# Altium project sgnd_rings.PrjPcb
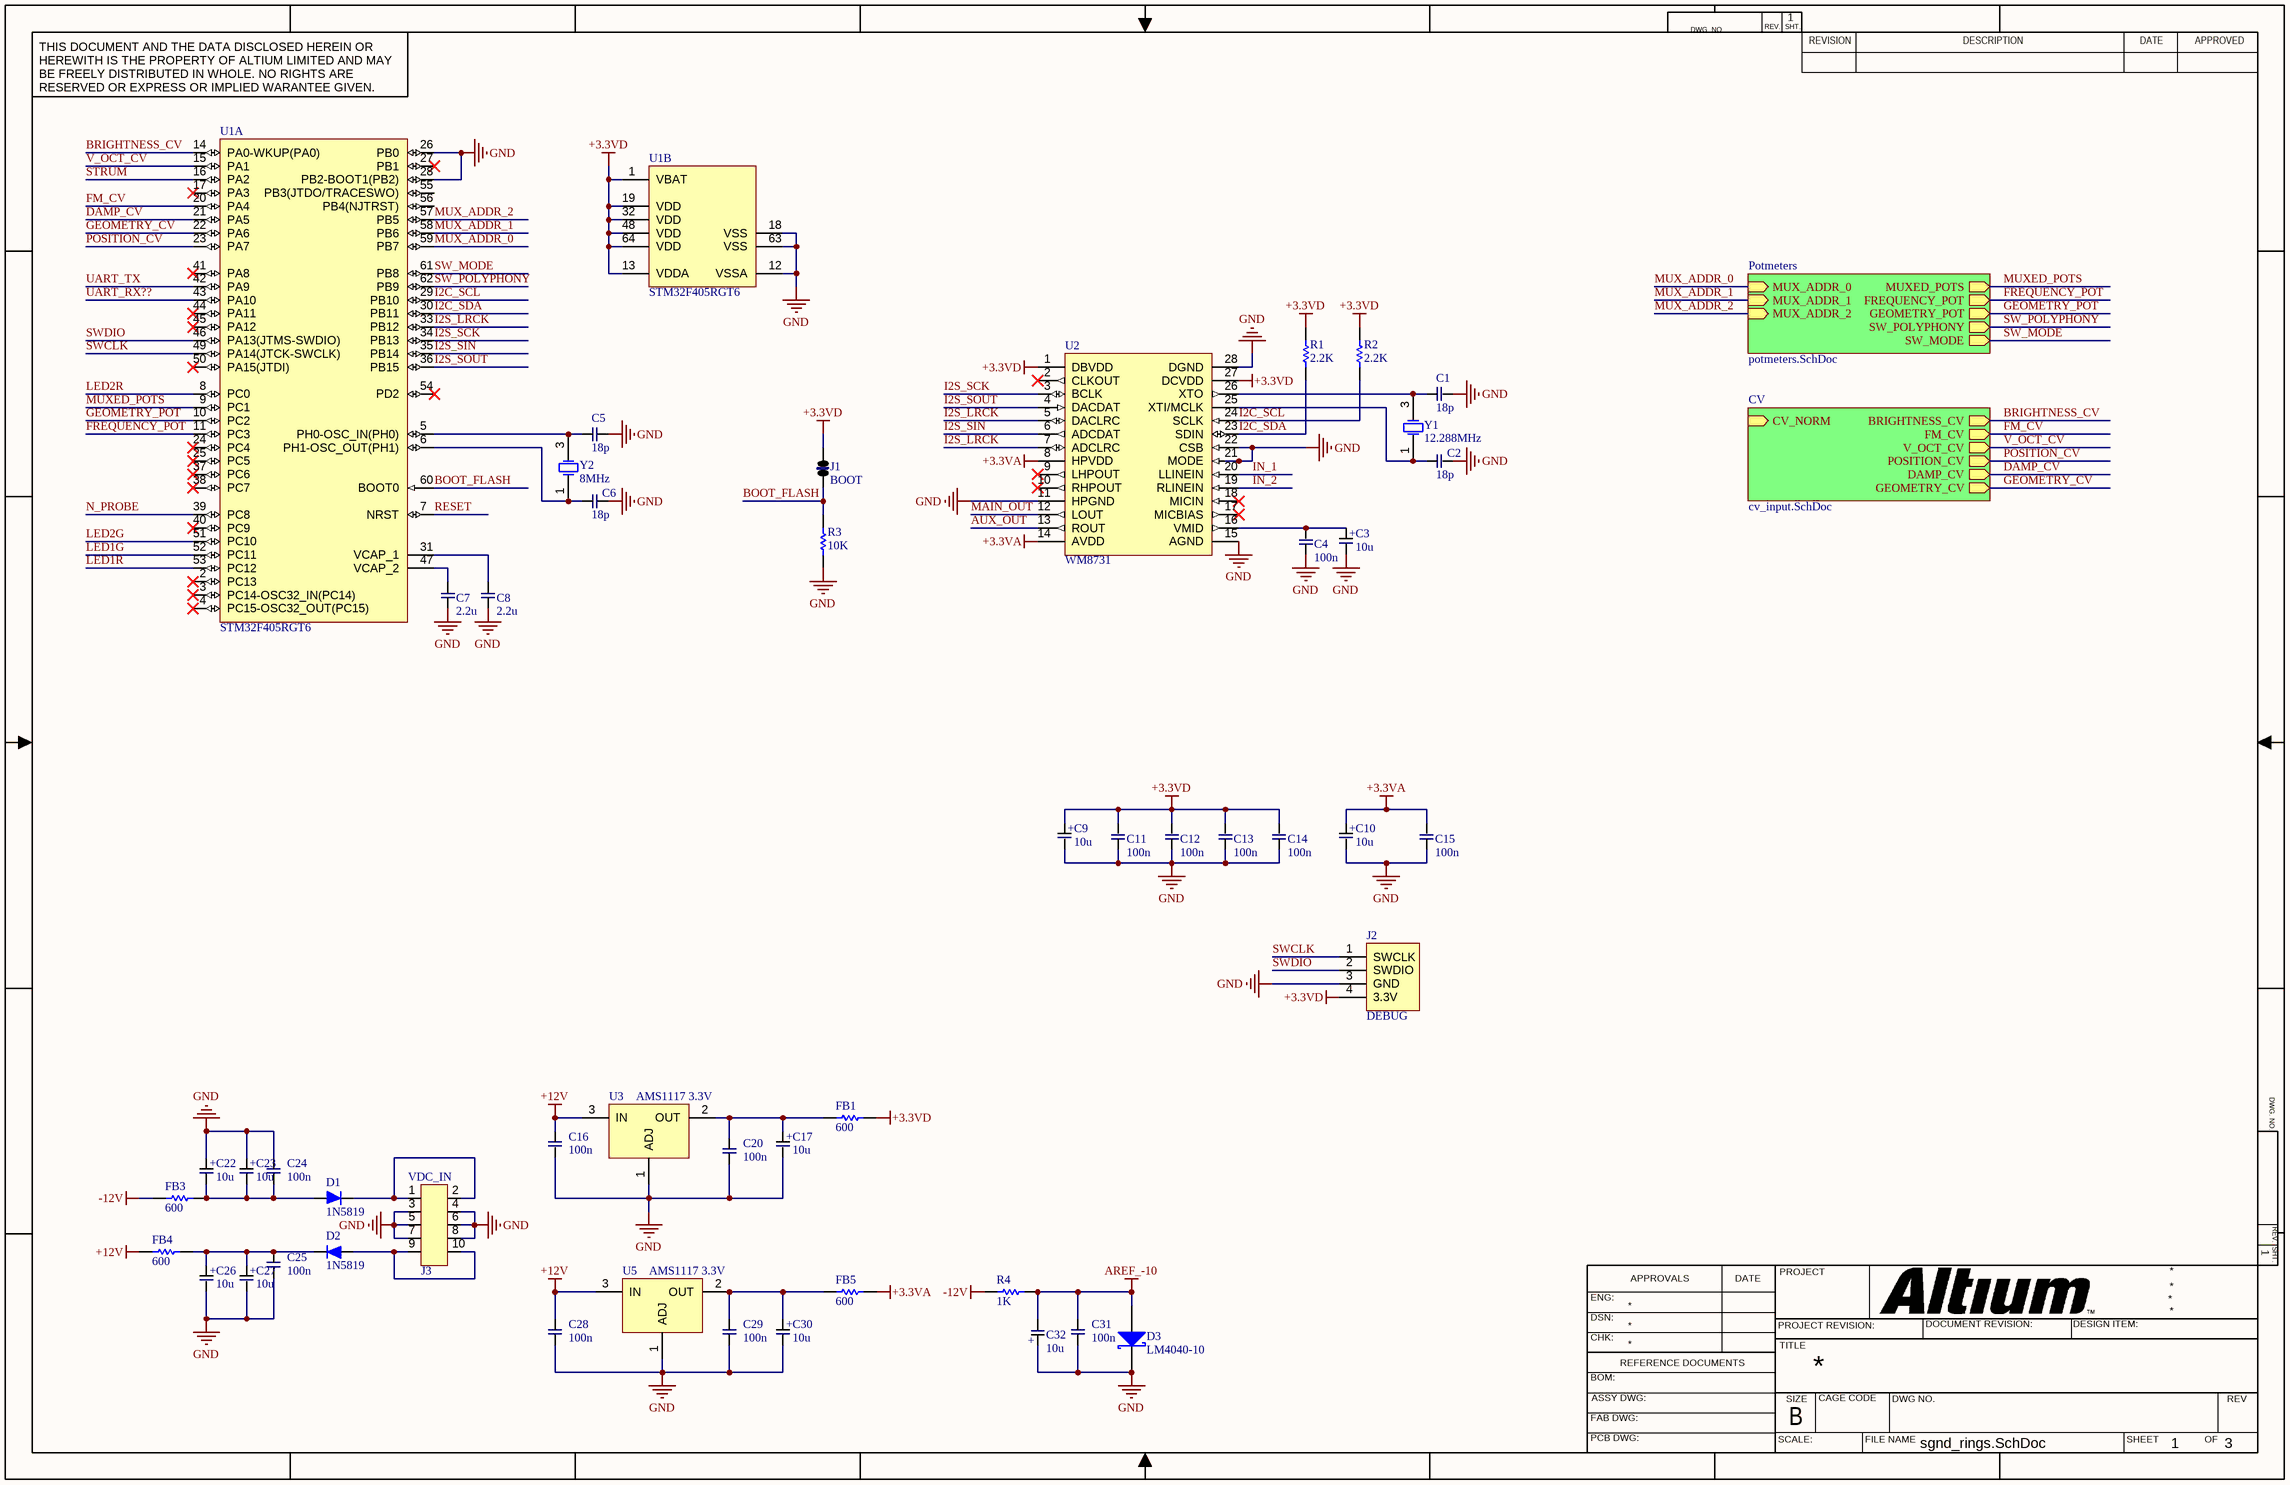
[diagram p0: sgnd_rings.SchDoc]
4 sheets, 109 parts. Net scope: hierarchical (ports join the sheet entries above them; power ports are global).
Board file: sgnd_rings.PcbDoc
Sheets:
  sgnd_rings.SchDoc
    Potmeters = potmeters.SchDoc
    CV = cv_input.SchDoc
  audio.SchDoc

## Sheet sgnd_rings.SchDoc
size 431 x 279 mm; SheetNumber: 1; SheetTotal: 3

### Parts
C1  value 18p  [C0603]  (hidden comment: Capacitor)
C2  value 18p  [C0603]  (hidden comment: Capacitor)
C3  value 10u  [ELCO_SMD_4x5.3mm]  (hidden comment: C_ELCO)
C4  value 100n  [C0603]  (hidden comment: Capacitor)
C5  value 18p  [C0603]  (hidden comment: Capacitor)
C6  value 18p  [C0603]  (hidden comment: Capacitor)
C7  value 2.2u  [C0603]  (hidden comment: Capacitor)
C8  value 2.2u  [C0603]  (hidden comment: Capacitor)
C9  value 10u  [ELCO_SMD_4x5.3mm]  (hidden comment: C_ELCO)
C10  value 10u  [ELCO_SMD_4x5.3mm]  (hidden comment: C_ELCO)
C11  value 100n  [C0603]  (hidden comment: Capacitor)
C12  value 100n  [C0603]  (hidden comment: Capacitor)
C13  value 100n  [C0603]  (hidden comment: Capacitor)
C14  value 100n  [C0603]  (hidden comment: Capacitor)
C15  value 100n  [C0603]  (hidden comment: Capacitor)
C16  value 100n  [C0603]  (hidden comment: Capacitor)
C17  value 10u  [ELCO_SMD_4x5.3mm]  (hidden comment: C_ELCO)
C20  value 100n  [C0603]  (hidden comment: Capacitor)
C22  value 10u  [ELCO_SMD_4x5.3mm]  (hidden comment: C_ELCO)
C23  value 10u  [ELCO_SMD_4x5.3mm]  (hidden comment: C_ELCO)
C24  value 100n  [C0603]  (hidden comment: Capacitor)
C25  value 100n  [C0603]  (hidden comment: Capacitor)
C26  value 10u  [ELCO_SMD_4x5.3mm]  (hidden comment: C_ELCO)
C27  value 10u  [ELCO_SMD_4x5.3mm]  (hidden comment: C_ELCO)
C28  value 100n  [C0603]  (hidden comment: Capacitor)
C29  value 100n  [C0603]  (hidden comment: Capacitor)
C30  value 10u  [ELCO_SMD_4x5.3mm]  (hidden comment: C_ELCO)
C31  value 100n  [C0603]  (hidden comment: Capacitor)
C32  value 10u  [ELCO_SMD_4x5.3mm]  (hidden comment: C_ELCO)
D1  value 1N5819  [DIODE_SOD-123]  (hidden comment: 1N4148)
D2  value 1N5819  [DIODE_SOD-123]  (hidden comment: 1N4148)
D3  LM4040-10  [SOT-23_M]
FB1  value 600  [R0603]  (hidden comment: RESISTOR)
FB3  value 600  [R0603]  (hidden comment: RESISTOR)
FB4  value 600  [R0603]  (hidden comment: RESISTOR)
FB5  value 600  [R0603]  (hidden comment: RESISTOR)
J1  BOOT  [JUMPER_2.54]
J2  DEBUG  [4PIN_CONNECTOR_VERTICAL_1,25MM_P - duplicate]
J3  IDC_socket_10pin  [IDC10]  (value not drawn)
R1  value 2.2K  [R0603]  (hidden comment: RESISTOR)
R2  value 2.2K  [R0603]  (hidden comment: RESISTOR)
R3  value 10K  [R0603]  (hidden comment: RESISTOR)
R4  value 1K  [R0603]  (hidden comment: RESISTOR)
U1  STM32F405RGT6  [STM-LQFP64_N]  (parts A,B of 2)
U2  WM8731  [SSOP-28_L]
U3  value AMS1117 3.3V  [SOT223]  (hidden comment: AMS1117_5V)
U5  value AMS1117 3.3V  [SOT223]  (hidden comment: AMS1117_5V)
Y1  12.288MHz  [XTAL_SMD_3.2x2.5x0.8]
Y2  8MHz  [XTAL_SMD_3.2x2.5x0.8]

### Sub-sheets
CV = cv_input.SchDoc: BRIGHTNESS_CV (out), FM_CV (out), V_OCT_CV (out), POSITION_CV (out), DAMP_CV (out), GEOMETRY_CV (out), CV_NORM (in)
Potmeters = potmeters.SchDoc: MUX_ADDR_0 (in), MUX_ADDR_1 (in), MUX_ADDR_2 (in), MUXED_POTS (out), FREQUENCY_POT (out), GEOMETRY_POT (out), SW_POLYPHONY (out), SW_MODE (out)

### Nets
+3.3VA: C10.1(+) C15.2 FB5.1 U2.8(HPVDD) U2.14(AVDD)
+3.3VD: C9.1(+) C11.2 C12.2 C13.2 C14.2 FB1.1 J1.2(C2) J2.4(3.3V) R1.2 R2.2 U1.1(VBAT) U1.13(VDDA) U1.19(VDD) U1.32(VDD) U1.48(VDD) U1.64(VDD) U2.1(DBVDD) U2.27(DCVDD)
+12V: C16.1 C28.1 FB4.2 U3.3(IN) U5.3(IN)
-12V: FB3.2 R4.2
AREF_-10: C31.1 C32.2(-) D3.2(-) R4.1
GND: C1.2 C2.2 C3.2(-) C4.1 C5.2 C6.2 C7.1 C8.1 C9.2(-) C10.2(-) C11.1 C12.1 C13.1 C14.1 C15.1 C16.2 C17.2(-) C20.2 C22.1(+) C23.1(+) C24.1 C25.2 C26.2(-) C27.2(-) C28.2 C29.2 C30.2(-) C31.2 C32.1(+) D3.1(+) J2.3(GND) J3.3 J3.4 J3.5 J3.6 J3.7 J3.8 R3.1 U1.12(VSSA) U1.18(VSS) U1.26(PB0) U1.28(PB2-BOOT1(PB2)) U1.63(VSS) U2.11(HPGND) U2.15(AGND) U2.21(MODE) U2.22(CSB) U2.28(DGND) U3.1(ADJ) U5.1(ADJ)
AUX_OUT: U2.13(ROUT)
BOOT_FLASH: J1.1(C1) R3.2 U1.60(BOOT0)
BRIGHTNESS_CV: U1.14(PA0-WKUP(PA0)) ; sheet CV/BRIGHTNESS_CV
DAMP_CV: U1.21(PA5) ; sheet CV/DAMP_CV
FM_CV: U1.20(PA4) ; sheet CV/FM_CV
FREQUENCY_POT: U1.11(PC3) ; sheet Potmeters/FREQUENCY_POT
GEOMETRY_CV: U1.22(PA6) ; sheet CV/GEOMETRY_CV
GEOMETRY_POT: U1.10(PC2) ; sheet Potmeters/GEOMETRY_POT
I2C_SCL: R2.1 U1.29(PB10) U2.24(SCLK)
I2C_SDA: R1.1 U1.30(PB11) U2.23(SDIN)
I2S_LRCK: U1.33(PB12) U2.5(DACLRC) U2.7(ADCLRC)
I2S_SCK: U1.34(PB13) U2.3(BCLK)
I2S_SIN: U1.35(PB14) U2.6(ADCDAT)
I2S_SOUT: U1.36(PB15) U2.4(DACDAT)
IN_1: U2.20(LLINEIN)
IN_2: U2.19(RLINEIN)
LED1G: U1.52(PC11)
LED1R: U1.53(PC12)
LED2G: U1.51(PC10)
LED2R: U1.8(PC0)
MAIN_OUT: U2.12(LOUT)
MUX_ADDR_0: U1.59(PB7) ; sheet Potmeters/MUX_ADDR_0
MUX_ADDR_1: U1.58(PB6) ; sheet Potmeters/MUX_ADDR_1
MUX_ADDR_2: U1.57(PB5) ; sheet Potmeters/MUX_ADDR_2
MUXED_POTS: U1.9(PC1) ; sheet Potmeters/MUXED_POTS
N_PROBE: U1.39(PC8)
POSITION_CV: U1.23(PA7) ; sheet CV/POSITION_CV
RESET: U1.7(NRST)
STRUM: U1.16(PA2)
SW_MODE: U1.61(PB8) ; sheet Potmeters/SW_MODE
SW_POLYPHONY: U1.62(PB9) ; sheet Potmeters/SW_POLYPHONY
SWCLK: J2.1(SWCLK) U1.49(PA14(JTCK-SWCLK))
SWDIO: J2.2(SWDIO) U1.46(PA13(JTMS-SWDIO))
UART_RX??: U1.43(PA10)
UART_TX: U1.42(PA9)
V_OCT_CV: U1.15(PA1) ; sheet CV/V_OCT_CV
NetC1_1: C1.1 U2.26(XTO) Y1.3(OSC2)
NetC2_1: C2.1 U2.25(XTI/MCLK) Y1.1(OSC1)
NetC3_1: C3.1(+) C4.2 U2.16(VMID)
NetC5_1: C5.1 U1.5(PH0-OSC_IN(PH0)) Y2.3(OSC2)
NetC6_1: C6.1 U1.6(PH1-OSC_OUT(PH1)) Y2.1(OSC1)
NetC7_2: C7.2 U1.47(VCAP_2)
NetC8_2: C8.2 U1.31(VCAP_1)
NetC17_1: C17.1(+) C20.1 FB1.2 U3.2(OUT)
NetC22_2: C22.2(-) C23.2(-) C24.2 D1.2(A) FB3.1
NetC25_1: C25.1 C26.1(+) C27.1(+) D2.1(K) FB4.1
NetC29_1: C29.1 C30.1(+) FB5.2 U5.2(OUT)
NetD1_1: D1.1(K) J3.1 J3.2
NetD2_2: D2.2(A) J3.9 J3.10

Not connected (* = marked no-connect by the designer): U1 2(PC13)* 3(PC14-OSC32_IN(PC14))* 4(PC15-OSC32_OUT(PC15))* 17(PA3)* 24(PC4)* 25(PC5)* 27(PB1)* 37(PC6)* 38(PC7)* 40(PC9)* 41(PA8)* 44(PA11)* 45(PA12)* 50(PA15(JTDI))* 54(PD2)* 55(PB3(JTDO/TRACESWO)) 56(PB4(NJTRST)); U2 2(CLKOUT)* 9(LHPOUT)* 10(RHPOUT)* 17(MICBIAS)* 18(MICIN)*

### Notes on the sheet
- (near J3) VDC_IN
- DWG. NO.
- REV.
- SHT.
- THIS DOCUMENT AND THE DATA DISCLOSED HEREIN OR HEREWITH IS THE PROPERTY OF ALTIUM LIMITED AND MAY BE FREELY DISTRIBUTED IN WHOLE. NO RIGHTS ARE RESERVED OR EXPRESS OR IMPLIED WARANTEE GIVEN.
- REVISION
- DESCRIPTION
- DATE
- APPROVED
- ENG:
- APPROVALS
- PROJECT
- DSN:
- CHK:
- REFERENCE DOCUMENTS
- PROJECT REVISION:
- TITLE
- DOCUMENT REVISION:
- DESIGN ITEM:
- BOM:
- FAB DWG:
- PCB DWG:
- ASSY DWG:
- SCALE:
- SIZE
- B
- CAGE CODE
- FILE NAME
- DWG NO.
- SHEET
- OF
- REV

### Library data of the parts
C1 C2 C4-C8 C11-C16 C20 C24 C25 C28 C29 C31 = Capacitor: Capacitor (Semiconductor SIM Model); Published: 8-Jun-2000; LatestRevisionDate: 29-May-2009; LatestRevisionNote: IPC-7351 Footprint Added.; PackageReference: C1206; Publisher: Altium Limited; PackageDescription: Chip Capacitor
D1 D2 = 1N5819: 1 Amp General Purpose Rectifier; Published: 8-Jun-2000; LatestRevisionDate: 17-Jul-2002; LatestRevisionNote: Re-released for DXP Platform.; DatasheetVersion: 1998; PackageVersion: Aug-1999; PackageReference: DO-41; Publisher: Altium Limited; PackageDescription: Diode, Axial; Body 5.2 x 2.7 mm (LxDia. max), Lead Dia. 0.86 mm (max); Code_JEDEC: DO-204-AL
D3 = LM4040-10: LM4040 Precision Micropower Shunt Voltage Reference 10V; Value: LM4040-10; JLC Part Number: C201738
J1 = Jumper: Jumper Wire; Published: 24-Mar-1999; LatestRevisionDate: 17-Jul-2002; LatestRevisionNote: Re-released for DXP Platform.; PackageReference: RAD-0.2; Publisher: Altium Limited; PackageDescription: Radial Cap, Thru-Hole; 2 Leads; 0.2 in Pin Spacing
J2 = STM32_SWD_PROGRAMMER: Value: STM32_SWD_PROGRAMMER
J3 = IDC_socket_10pin: Value: IDC10 socket
U1 = STM32F405RGT6: ARM Cortex-M4 32-bit MCU+FPU, 210 DMIPS, 1024 kB Flash, 192 kB Internal RAM, 51 I/Os, 64-pin LQFP, -40 to 85 degC, Tray; Manufacturer: STMicroelectronics; D/A Converter: 2x12-bit; FLASH Size (Prog) (kB): 1024; I/Os (High Current): 51; Internal RAM Size (kB): 192; Operating Frequency(F) (Processor speed) (MHz): 168; Supply Voltage(Vcc) max (V): 3.6; Supply Voltage(Vcc) min (V): 1.8; DatasheetVersion: Rev. 4; PackageVersion: Rev. 4, 06/2013; PackageReference: LQFP64; PackageDescription: 64-Pin Low Profile Quad Flat Package, 10 x 10 mm Body, 0.5 mm Pitch; Supplier 1: Digi-Key; Supplier Part Number 1: 497-11767-ND; Supplier 2: Farnell; Supplier Part Number 2: 2064363; Supplier 3: Newark; Supplier Part Number 3: 73T2329; Supplier 4: Mouser; Supplier Part Number 4: 511-STM32F405RGT6; Core: ARM Cortex-M4; Packing: Tray; Mounting Technology: Surface Mount; PartNumber: STM32F405RGT6; ComponentLink1Description: Manufacturer URL; ComponentLink1URL: http://www.st.com/web/en/home.html; ComponentLink2Description: Datasheet; ComponentLink2URL: http://www.st.com/st-web-ui/static/active/en/resource/technical/document/datasheet/DM00037051.pdf; ComponentLink3Description: Package Specification; ComponentLink3URL: http://www.st.com/st-web-ui/static/active/en/resource/technical/document/datasheet/DM00037051.pdf
U2 = WM8731: Portable Internet Audio CODEC with Headphone Driver / and Programmable Sample Rates; Manufacturer: Microchip; PartNumber: MCP4822-E/P; DatasheetVersion: revA, Apr-2010; PackageVersion: revBB, Aug-2009; PackageReference: PDIP300-P8; PackageDescription: 8-Lead Plastic Dual In-Line (P) - 300 mil Body [PDIP]; Supplier 1: Digi-Key; Supplier Part Number 1: MCP4822-E/P-ND; Supplier 2: Farnell; Supplier Part Number 2: 1439413; Supplier 3: Newark; Supplier Part Number 3: 11M1705; Supplier 4: Mouser; Supplier Part Number 4: 579-MCP4822-E/P; Mounting Technology: Through Hole; Code_JEDEC: MS-001; Value: WM8731
Y1 Y2 = XTAL_3225-24.576M-SR: Crystal Oscillator; Value: XTAL; Published: 8-Jun-2000; LatestRevisionDate: 17-Jul-2002; LatestRevisionNote: Re-released for DXP Platform.; PackageReference: R38; Publisher: Altium Limited; PackageDescription: Crystal, Thru-Hole; 2 Leads; Body 3.1 x 8.2 mm (Dia.xH)
FB1 FB3-FB5 R1-R4 = RESISTOR: Published: 8-Jun-2000; LatestRevisionDate: 17-Jul-2002; LatestRevisionNote: Re-released for DXP Platform.; PackageReference: AXIAL-0.3; Publisher: Altium Limited; PackageDescription: Axial Device, Thru-Hole; 2 Leads; 0.3 in Pin Spacing

## Sheet potmeters.SchDoc
size A4; SheetNumber: 2; SheetTotal: 4
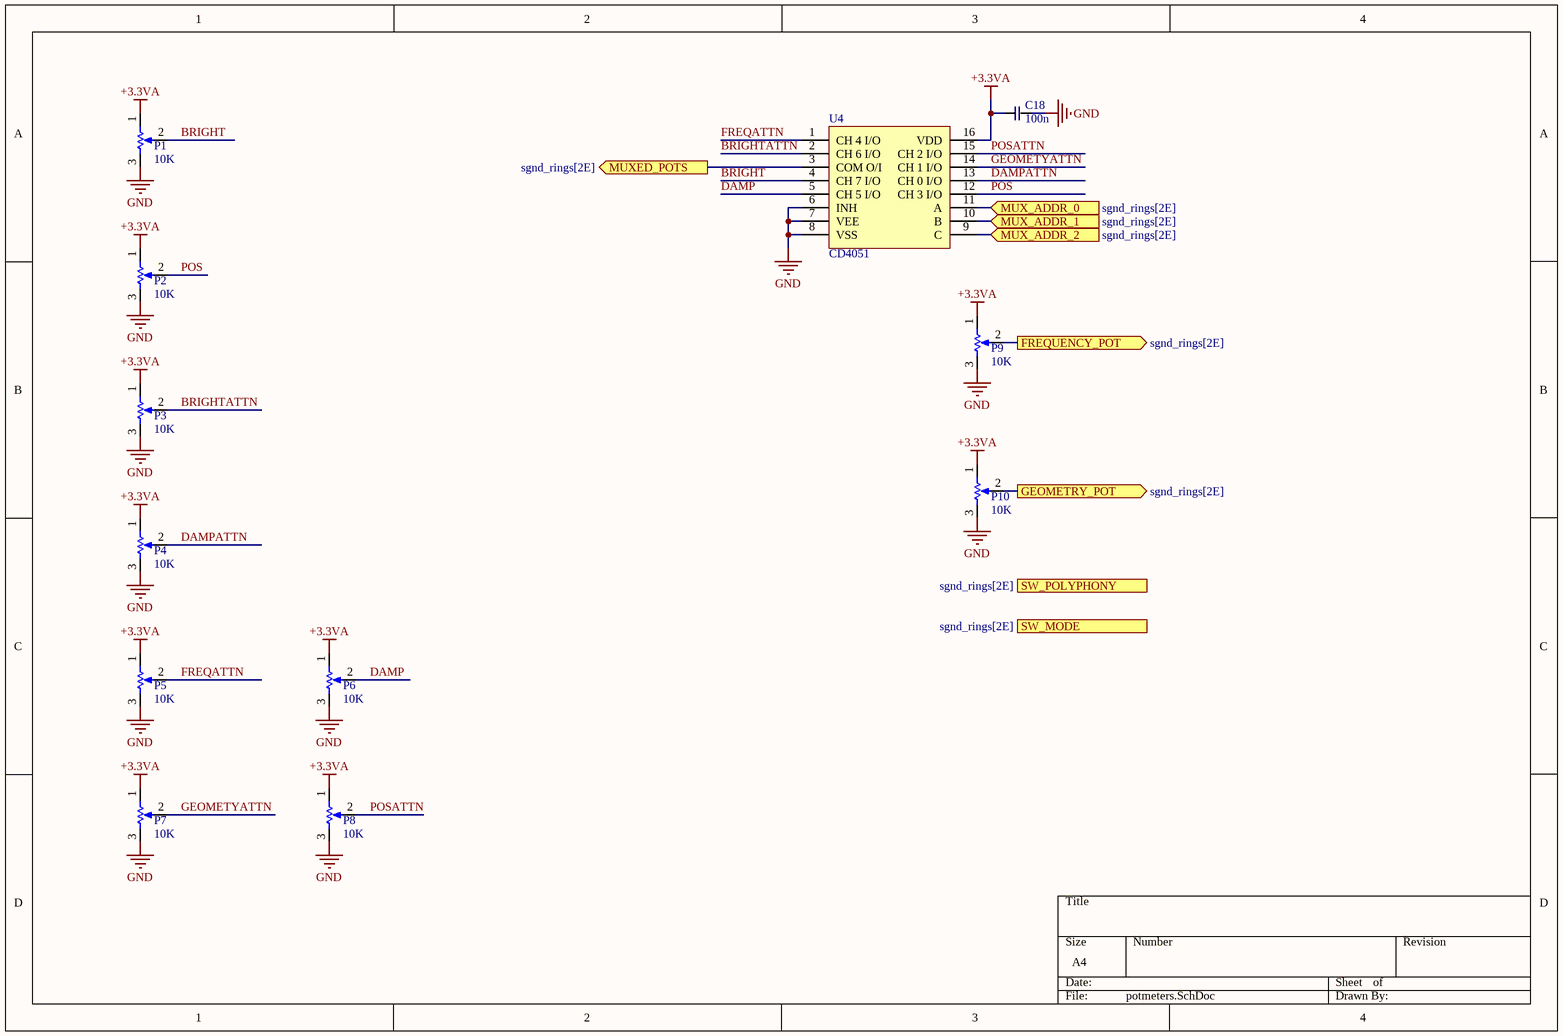
[diagram p1: potmeters.SchDoc]

### Parts
C18  value 100n  [C0603]  (hidden comment: Capacitor)
P1  value 10K  [Potentiometer_vertical]  (hidden comment: BRIGHT)
P2  value 10K  [Potentiometer_vertical]  (hidden comment: BRIGHT)
P3  value 10K  [Potentiometer_vertical]  (hidden comment: BRIGHT)
P4  value 10K  [Potentiometer_vertical]  (hidden comment: BRIGHT)
P5  value 10K  [Potentiometer_vertical]  (hidden comment: BRIGHT)
P6  value 10K  [Potentiometer_vertical]  (hidden comment: BRIGHT)
P7  value 10K  [Potentiometer_vertical]  (hidden comment: BRIGHT)
P8  value 10K  [Potentiometer_vertical]  (hidden comment: BRIGHT)
P9  value 10K  [Potentiometer_vertical]  (hidden comment: BRIGHT)
P10  value 10K  [Potentiometer_vertical]  (hidden comment: BRIGHT)
U4  CD4051  [SOP16]

### Ports
FREQUENCY_POT (out, see sgnd_rings[2E]), GEOMETRY_POT (out, see sgnd_rings[2E]), MUX_ADDR_0 (in, see sgnd_rings[2E]), MUX_ADDR_1 (in, see sgnd_rings[2E]), MUX_ADDR_2 (in, see sgnd_rings[2E]), MUXED_POTS (out, see sgnd_rings[2E]), SW_MODE (out, see sgnd_rings[2E]), SW_POLYPHONY (out, see sgnd_rings[2E])

### Nets
+3.3VA: C18.1 P1.1(BOT) P2.1(BOT) P3.1(BOT) P4.1(BOT) P5.1(BOT) P6.1(BOT) P7.1(BOT) P8.1(BOT) P9.1(BOT) P10.1(BOT) U4.16(VDD)
GND: C18.2 P1.3(TOP) P2.3(TOP) P3.3(TOP) P4.3(TOP) P5.3(TOP) P6.3(TOP) P7.3(TOP) P8.3(TOP) P9.3(TOP) P10.3(TOP) U4.6(INH) U4.7(VEE) U4.8(VSS)
BRIGHT: P1.2(TAP) U4.4(CH_7_I/O)
BRIGHTATTN: P3.2(TAP) U4.2(CH_6_I/O)
DAMP: P6.2(TAP) U4.5(CH_5_I/O)
DAMPATTN: P4.2(TAP) U4.13(CH_0_I/O)
FREQATTN: P5.2(TAP) U4.1(CH_4_I/O)
FREQUENCY_POT: P9.2(TAP) ; port FREQUENCY_POT
GEOMETRY_POT: P10.2(TAP) ; port GEOMETRY_POT
GEOMETYATTN: P7.2(TAP) U4.14(CH_1_I/O)
MUX_ADDR_0: U4.11(A) ; port MUX_ADDR_0
MUX_ADDR_1: U4.10(B) ; port MUX_ADDR_1
MUX_ADDR_2: U4.9(C) ; port MUX_ADDR_2
MUXED_POTS: U4.3(COM_O/I) ; port MUXED_POTS
POS: P2.2(TAP) U4.12(CH_3_I/O)
POSATTN: P8.2(TAP) U4.15(CH_2_I/O)

### Library data of the parts
C18 = Capacitor: Capacitor (Semiconductor SIM Model); Published: 8-Jun-2000; LatestRevisionDate: 29-May-2009; LatestRevisionNote: IPC-7351 Footprint Added.; PackageReference: C1206; Publisher: Altium Limited; PackageDescription: Chip Capacitor
P1-P10 = RPot: Potentiometer; Sim Note: Enter the Resistance value and the set point into parameter fields.; Set Position: 0.5; Published: 8-Jun-2000; LatestRevisionDate: 17-Jul-2002; LatestRevisionNote: Re-released for DXP Platform.; PackageReference: VR5; Publisher: Altium Limited; PackageDescription: Variable Resistor, Thru-Hole; 3 Leads
U4 = CD4051: CD4051 CMOS Single 8-Channel Analog Multiplexer/Demultiplexer  With Logic-Level Conversion; Value: CD4051

## Sheet cv_input.SchDoc
size A4; SheetNumber: 3; SheetTotal: 3
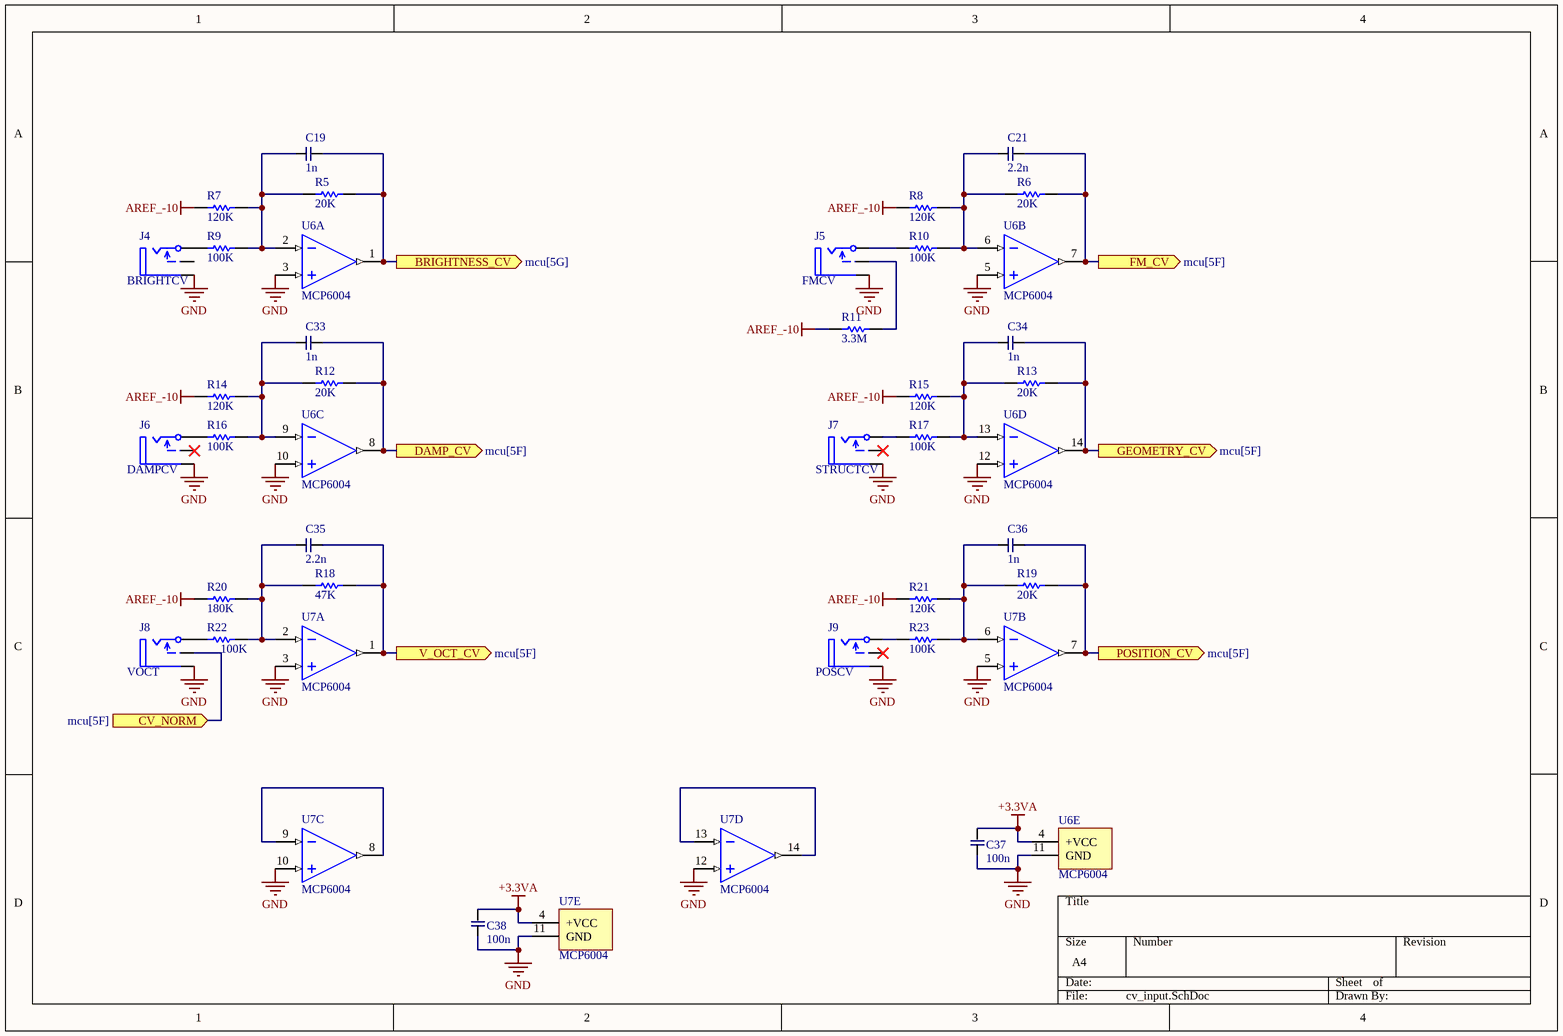
[diagram p2: cv_input.SchDoc]

### Parts
C19  value 1n  [C0603]  (hidden comment: Capacitor)
C21  value 2.2n  [C0603]  (hidden comment: Capacitor)
C33  value 1n  [C0603]  (hidden comment: Capacitor)
C34  value 1n  [C0603]  (hidden comment: Capacitor)
C35  value 2.2n  [C0603]  (hidden comment: Capacitor)
C36  value 1n  [C0603]  (hidden comment: Capacitor)
C37  value 100n  [C0603]  (hidden comment: Capacitor)
C38  value 100n  [C0603]  (hidden comment: Capacitor)
J4  BRIGHTCV  [PJ301_thonk]
J5  FMCV  [PJ301_thonk]
J6  DAMPCV  [PJ301_thonk]
J7  STRUCTCV  [PJ301_thonk]
J8  VOCT  [PJ301_thonk]
J9  POSCV  [PJ301_thonk]
R5  value 20K  [R0603]  (hidden comment: RESISTOR)
R6  value 20K  [R0603]  (hidden comment: RESISTOR)
R7  value 120K  [R0603]  (hidden comment: RESISTOR)
R8  value 120K  [R0603]  (hidden comment: RESISTOR)
R9  value 100K  [R0603]  (hidden comment: RESISTOR)
R10  value 100K  [R0603]  (hidden comment: RESISTOR)
R11  value 3.3M  [R0603]  (hidden comment: RESISTOR)
R12  value 20K  [R0603]  (hidden comment: RESISTOR)
R13  value 20K  [R0603]  (hidden comment: RESISTOR)
R14  value 120K  [R0603]  (hidden comment: RESISTOR)
R15  value 120K  [R0603]  (hidden comment: RESISTOR)
R16  value 100K  [R0603]  (hidden comment: RESISTOR)
R17  value 100K  [R0603]  (hidden comment: RESISTOR)
R18  value 47K  [R0603]  (hidden comment: RESISTOR)
R19  value 20K  [R0603]  (hidden comment: RESISTOR)
R20  value 180K  [R0603]  (hidden comment: RESISTOR)
R21  value 120K  [R0603]  (hidden comment: RESISTOR)
R22  value 100K  [R0603]  (hidden comment: RESISTOR)
R23  value 100K  [R0603]  (hidden comment: RESISTOR)
U6  MCP6004  [SOP14_L]  (parts A,B,C,D,E of 5)
U7  MCP6004  [SOP14_L]  (parts A,B,C,D,E of 5)

### Ports
BRIGHTNESS_CV (out, see mcu[5G]), CV_NORM (in, see mcu[5F]), DAMP_CV (out, see mcu[5F]), FM_CV (out, see mcu[5F]), GEOMETRY_CV (out, see mcu[5F]), POSITION_CV (out, see mcu[5F]), V_OCT_CV (out, see mcu[5F])

### Nets
+3.3VA: C37.2 C38.2 U6.4(+VCC) U7.4(+VCC)
AREF_-10: R7.1 R8.1 R11.1 R14.1 R15.1 R20.1 R21.1
GND: C37.1 C38.1 J4.1(Ground) J5.1(Ground) J6.1(Ground) J7.1(Ground) J8.1(Ground) J9.1(Ground) U6.3(IN1+) U6.5(IN2+) U6.10(IN3+) U6.11(GND) U6.12(IN4+) U7.3(IN1+) U7.5(IN2+) U7.10(IN3+) U7.11(GND) U7.12(IN4+)
BRIGHTNESS_CV: C19.2 R5.2 U6.1(OUT1) ; port BRIGHTNESS_CV
DAMP_CV: C33.2 R12.2 U6.8(OUT3) ; port DAMP_CV
FM_CV: C21.2 R6.2 U6.7(OUT2) ; port FM_CV
GEOMETRY_CV: C34.2 R13.2 U6.14(OUT4) ; port GEOMETRY_CV
POSITION_CV: C36.2 R19.2 U7.7(OUT2) ; port POSITION_CV
V_OCT_CV: C35.2 R18.2 U7.1(OUT1) ; port V_OCT_CV
NetC19_1: C19.1 R5.1 R7.2 R9.2 U6.2(IN1-)
NetC21_1: C21.1 R6.1 R8.2 R10.2 U6.6(IN2-)
NetC33_1: C33.1 R12.1 R14.2 R16.2 U6.9(IN3-)
NetC34_1: C34.1 R13.1 R15.2 R17.2 U6.13(IN4-)
NetC35_1: C35.1 R18.1 R20.2 R22.2 U7.2(IN1-)
NetC36_1: C36.1 R19.1 R21.2 R23.2 U7.6(IN2-)
NetJ4_3: J4.3(R_Aux_in) R9.1
NetJ5_2: J5.2(R_Radio_ch) R11.2
NetJ5_3: J5.3(R_Aux_in) R10.1
NetJ6_3: J6.3(R_Aux_in) R16.1
NetJ7_3: J7.3(R_Aux_in) R17.1
NetJ8_2: J8.2(R_Radio_ch) ; port CV_NORM
NetJ8_3: J8.3(R_Aux_in) R22.1
NetJ9_3: J9.3(R_Aux_in) R23.1
NetU7_8: U7.8(OUT3) U7.9(IN3-)
NetU7_13: U7.13(IN4-) U7.14(OUT4)

Not connected (* = marked no-connect by the designer): J4 2(R_Radio_ch); J6 2(R_Radio_ch)*; J7 2(R_Radio_ch)*; J9 2(R_Radio_ch)*

### Library data of the parts
C19 C21 C33-C38 = Capacitor: Capacitor (Semiconductor SIM Model); Published: 8-Jun-2000; LatestRevisionDate: 29-May-2009; LatestRevisionNote: IPC-7351 Footprint Added.; PackageReference: C1206; Publisher: Altium Limited; PackageDescription: Chip Capacitor
J4-J9 = Audio_jack_mono: Value: Audio_jack_mono
U6 U7 = MCP6004: Rail-to-Rail Input/Output, 10 MHz Op Amps; Manufacturer: Texas Instruments; PartNumber: TL074CN; CMRR(Min)(dB): 70; Eco-Plan: Pb-Free (RoHS); GBW(Typ)(MHz): 3; IIB(Max)(pA): 200; Iq per channel(Max)(mA): 2.5; Number of Channels: 4; Offset Drift(Typ)(uV/C): 18; Rating: Military; Slew Rate(Typ)(V/us): 13; Sub Family: General Purpose Amplifier, High Supply Voltage Amplifier (>=30V); Total Supply Voltage(Max)(+5V is 5, +/-5V is 10): 36; Total Supply Voltage(Min)(+5V is 5, +/-5V is 10): 7; Vio (25C)(Max)(mV): 10; DatasheetVersion: SLOS080J; PackageVersion: 4040049/E, 12/2002; PackageReference: N14; PackageDescription: 14-Pin Plastic In-Line, Body 19.305 x 6.35 mm, Pitch 2.54 mm; Supplier 1: Digi-Key; Supplier Part Number 1: 296-1777-5-ND; Supplier 2: Newark; Supplier Part Number 2: 60K6990; Supplier 3: Mouser; Supplier Part Number 3: 595-TL074CN; Vn at 1kHz(Typ)(nV/rtHz): 18; Mounting Technology: Through Hole; Code_JEDEC: MS-001; Value: MCP6004; LCSC Part: C7378
R5-R23 = RESISTOR: Published: 8-Jun-2000; LatestRevisionDate: 17-Jul-2002; LatestRevisionNote: Re-released for DXP Platform.; PackageReference: AXIAL-0.3; Publisher: Altium Limited; PackageDescription: Axial Device, Thru-Hole; 2 Leads; 0.3 in Pin Spacing

## Sheet audio.SchDoc
size A4; SheetNumber: 4; SheetTotal: 4
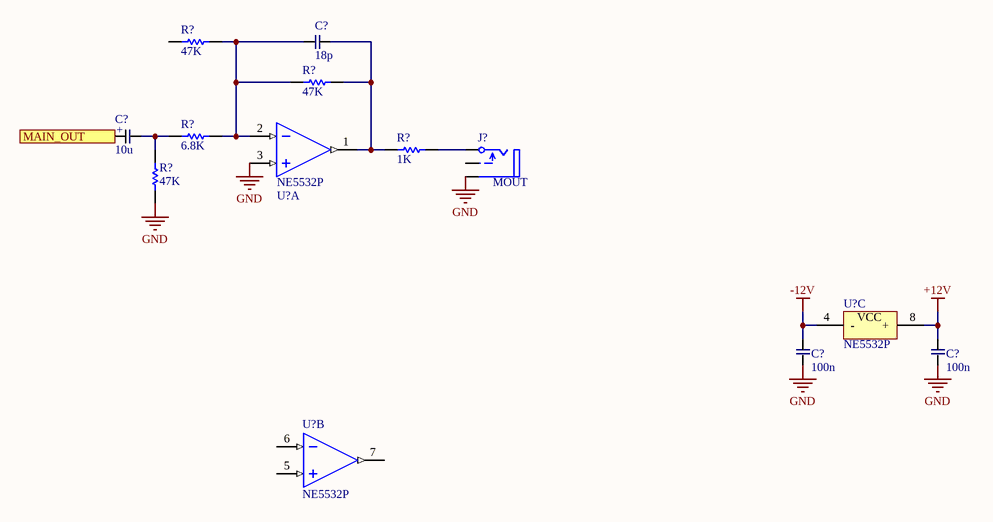
[diagram p3: audio.SchDoc]

### Parts
(Parts that share a designator on the sheet are numbered #1, #2 ... from top to bottom, then left to right.)
C?#1  value 18p  [C0603]  (hidden comment: Capacitor)
C?#2  value 10u  [ELCO_SMD_4x5.3mm]  (hidden comment: C_ELCO)
C?#3  value 100n  [C0603]  (hidden comment: Capacitor)
C?#4  value 100n  [C0603]  (hidden comment: Capacitor)
J?  MOUT  [PJ301_thonk]
R?#1  value 47K  [R0603]  (hidden comment: RESISTOR)
R?#2  value 47K  [R0603]  (hidden comment: RESISTOR)
R?#3  value 6.8K  [R0603]  (hidden comment: RESISTOR)
R?#4  value 1K  [R0603]  (hidden comment: RESISTOR)
R?#5  value 47K  [R0603]  (hidden comment: RESISTOR)
U?#1  NE5532P  [SOP8_M]  (part A of 3)
U?#2  NE5532P  [SOP8_M]  (part C of 3)
U?#3  NE5532P  [SOP8_M]  (part B of 3)

### Ports
MAIN_OUT (in)

### Nets
+12V: C?#4.1 U?#2.8(+)
-12V: C?#3.1 U?#2.4(-)
GND: C?#3.2 C?#4.2 J?.1(Ground) R?#5.1 U?#1.3(IN1+)
NetC?#1_1: C?#1.1 R?#2.2 R?#4.1 U?#1.1(OUT1)
NetC?#1_2: C?#1.2 R?#1.2 R?#2.1 R?#3.2 U?#1.2(IN1-)
NetC?#2_1: C?#2.1(+) ; port MAIN_OUT
NetC?#2_2: C?#2.2(-) R?#3.1 R?#5.2
NetJ?_3: J?.3(R_Aux_in) R?#4.2

Not connected (* = marked no-connect by the designer): J? 2(R_Radio_ch); R?#1 1; U?#3 5(IN2+) 6(IN2-) 7(OUT2)

### Notes on the sheet
- (in symbol NE5532P, part C) VCC

### Library data of the parts
C?#1 C?#3 C?#4 = Capacitor: Capacitor (Semiconductor SIM Model); Published: 8-Jun-2000; LatestRevisionDate: 29-May-2009; LatestRevisionNote: IPC-7351 Footprint Added.; PackageReference: C1206; Publisher: Altium Limited; PackageDescription: Chip Capacitor
J? = Audio_jack_mono: Value: Audio_jack_mono
U?#1-U?#3 = NE5532P: Dual Low-Noise High-Speed Audio Operational Amplifier, 10 to 30 V, 0 to 70 degC, 8-pin DIP (P8), Pb-Free (RoHS); Manufacturer: Texas Instruments; CMRR(Min)(dB): 70; GBW(Typ)(MHz): 10; IIB(Max)(pA): 800000; Iq per channel(Max)(mA): 4; Number of Channels: 2; Slew Rate(Typ)(V/us): 9; Sub Family: General Purpose Amplifier, High Supply Voltage Amplifier (>=30V), Low Noise Amp (<=10nV/rtHz); Total Supply Voltage(Max)(+5V is 5, +/-5V is 10): 30; Vn at 1kHz(Typ)(nV/rtHz): 5; DatasheetVersion: SLOS075I; PackageVersion: 4040082/E, 04/2010; PackageReference: P8; PackageDescription: 8-Pin Plastic In-Line, Body 9.59 x 6.35 mm, Pitch 2.54 mm; Supplier 1: Digi-Key; Supplier Part Number 1: 296-1410-5-ND; Supplier 2: Farnell; Supplier Part Number 2: 1106092; Supplier 3: Farnell; Supplier Part Number 3: 2119505; Supplier 4: Newark; Supplier Part Number 4: 59K8751; Supplier 5: Mouser; Supplier Part Number 5: 595-NE5532P; Eco-Plan: Pb-Free (RoHS); Total Supply Voltage(Min)(+5V is 5, +/-5V is 10): 10; Vio (25C)(Max)(mV): 4; Mounting Technology: Through Hole; Code_JEDEC: MS-001; PartNumber: NE5532P; ComponentLink1Description: Manufacturer URL; ComponentLink1URL: http://www.ti.com/; ComponentLink2Description: Datasheet; ComponentLink2URL: http://www.ti.com/lit/ds/symlink/ne5532.pdf; ComponentLink3Description: Package Specification; ComponentLink3URL: http://www.ti.com/litv/pdf/mpdi001b
R?#1-R?#5 = RESISTOR: Published: 8-Jun-2000; LatestRevisionDate: 17-Jul-2002; LatestRevisionNote: Re-released for DXP Platform.; PackageReference: AXIAL-0.3; Publisher: Altium Limited; PackageDescription: Axial Device, Thru-Hole; 2 Leads; 0.3 in Pin Spacing

## Nets that join several sheets
+3.3VA: sgnd_rings (5 pins), potmeters (12 pins), cv_input (C37.2 C38.2 U6.4 U7.4)
+12V: sgnd_rings (5 pins), audio (C?#4.1 U?#2.8)
-12V: sgnd_rings (FB3.2 R4.2), audio (C?#3.1 U?#2.4)
AREF_-10: sgnd_rings (C31.1 C32.2 D3.2 R4.1), cv_input (7 pins)
GND: sgnd_rings (50 pins), potmeters (14 pins), cv_input (18 pins), audio (5 pins)
BRIGHTNESS_CV: sgnd_rings (U1.14), cv_input (C19.2 R5.2 U6.1)
DAMP_CV: sgnd_rings (U1.21), cv_input (C33.2 R12.2 U6.8)
FM_CV: sgnd_rings (U1.20), cv_input (C21.2 R6.2 U6.7)
FREQUENCY_POT: sgnd_rings (U1.11), potmeters (P9.2)
GEOMETRY_CV: sgnd_rings (U1.22), cv_input (C34.2 R13.2 U6.14)
GEOMETRY_POT: sgnd_rings (U1.10), potmeters (P10.2)
MUX_ADDR_0: sgnd_rings (U1.59), potmeters (U4.11)
MUX_ADDR_1: sgnd_rings (U1.58), potmeters (U4.10)
MUX_ADDR_2: sgnd_rings (U1.57), potmeters (U4.9)
MUXED_POTS: sgnd_rings (U1.9), potmeters (U4.3)
POSITION_CV: sgnd_rings (U1.23), cv_input (C36.2 R19.2 U7.7)
V_OCT_CV: sgnd_rings (U1.15), cv_input (C35.2 R18.2 U7.1)